# Altium schematic sheet Cabinet_System_ADP.SchDoc
size A4; SheetNumber: 1; SheetTotal: 1
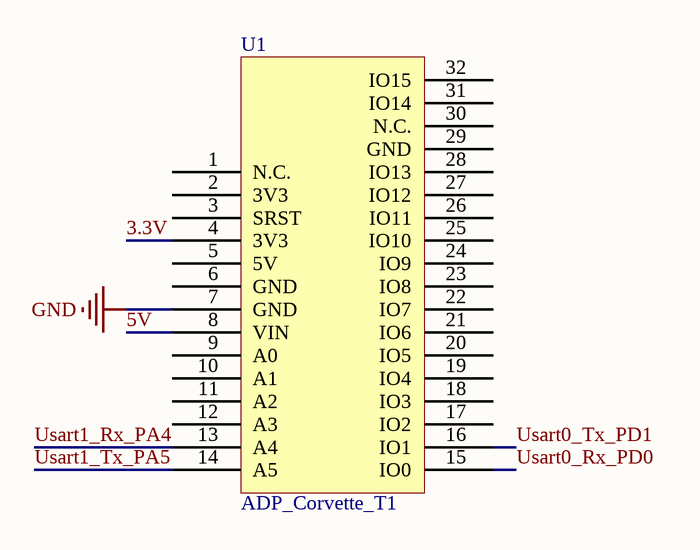
[diagram p0: Cabinet_System_ADP.SchDoc]

## Parts
U1  ADP_Corvette_T1  [Corvette_T1]

## Nets
GND: U1.7(GND)
3.3V: U1.4(3V3)
5V: U1.8(VIN)
Usart0_Rx_PD0: U1.15(IO0)
Usart0_Tx_PD1: U1.16(IO1)
Usart1_Rx_PA4: U1.13(A4)
Usart1_Tx_PA5: U1.14(A5)

Not connected (* = marked no-connect by the designer): U1 1(N.C.) 2(3V3) 3(SRST) 5(5V) 6(GND) 9(A0) 10(A1) 11(A2) 12(A3) 17(IO2) 18(IO3) 19(IO4) 20(IO5) 21(IO6) 22(IO7) 23(IO8) 24(IO9) 25(IO10) 26(IO11) 27(IO12) 28(IO13) 29(GND) 30(N.C.) 31(IO14) 32(IO15)

## Library data of the parts
U1 = Corvette_T1